# Altium schematic sheet Microcontroller.SchDoc
size A4; SheetNumber: 4; SheetTotal: 6
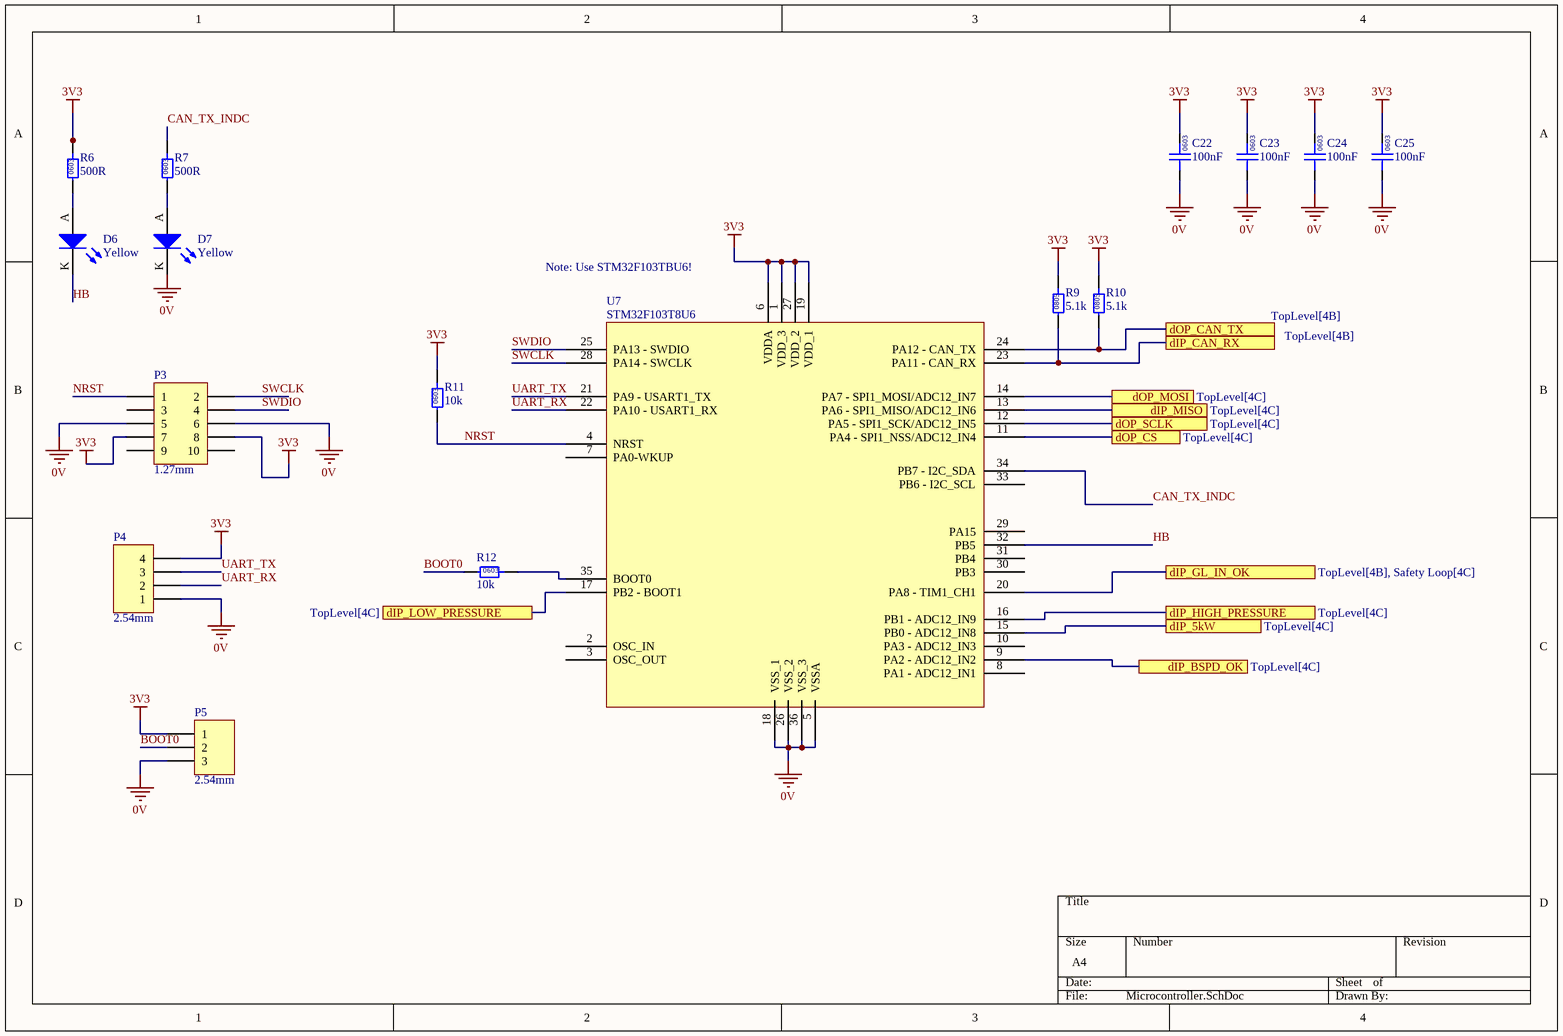
[diagram p0: Microcontroller.SchDoc]

## Parts
C22  100nF  [0603]
C23  100nF  [0603]
C24  100nF  [0603]
C25  100nF  [0603]
D6  Yellow  [0805 LED]
D7  Yellow  [0805 LED]
P3  1.27mm  [3221-10-0300-00]
P4  2.54mm  [TH 2.54mm Header 1x4]
P5  2.54mm  [TH 2.54mm Header 1x3]
R6  500R  [0603]
R7  500R  [0603]
R9  5.1k  [0805]
R10  5.1k  [0805]
R11  10k  [0603]
R12  10k  [0603]
U7  STM32F103T8U6  [STM_QFN-36]

## Ports
dIP_5kW (see TopLevel[4C]), dIP_BSPD_OK (see TopLevel[4C]), dIP_CAN_RX (see TopLevel[4B]), dIP_GL_IN_OK (see TopLevel[4B], Safety Loop[4C]), dIP_HIGH_PRESSURE (see TopLevel[4C]), dIP_LOW_PRESSURE (see TopLevel[4C]), dIP_MISO (see TopLevel[4C]), dOP_CAN_TX (see TopLevel[4B]), dOP_CS (see TopLevel[4C]), dOP_MOSI (see TopLevel[4C]), dOP_SCLK (see TopLevel[4C])

## Nets
0V: C22.1 C23.1 C24.1 C25.1 D7.K P3.5 P3.6 P4.1 P5.3 U7.5(VSSA) U7.18(VSS_1) U7.26(VSS_2) U7.36(VSS_3)
3V3: C22.2 C23.2 C24.2 C25.2 P3.7 P3.8 P4.4 P5.1 R6.2 R9.2 R10.2 R11.2 U7.1(VDD_3) U7.6(VDDA) U7.19(VDD_1) U7.27(VDD_2)
BOOT0: P5.2 R12.1
CAN_TX_INDC: R7.2 U7.34(PB7_-_I2C_SDA)
dIP_5kW: U7.15(PB0_-_ADC12_IN8) ; port dIP_5kW
dIP_BSPD_OK: U7.9(PA2_-_ADC12_IN2) ; port dIP_BSPD_OK
dIP_CAN_RX: R9.1 U7.23(PA11_-_CAN_RX) ; port dIP_CAN_RX
dIP_GL_IN_OK: U7.20(PA8_-_TIM1_CH1) ; port dIP_GL_IN_OK
dIP_HIGH_PRESSURE: U7.16(PB1_-_ADC12_IN9) ; port dIP_HIGH_PRESSURE
dIP_LOW_PRESSURE: U7.17(PB2_-_BOOT1) ; port dIP_LOW_PRESSURE
dIP_MISO: U7.13(PA6_-_SPI1_MISO/ADC12_IN6) ; port dIP_MISO
dOP_CAN_TX: R10.1 U7.24(PA12_-_CAN_TX) ; port dOP_CAN_TX
dOP_CS: U7.11(PA4_-_SPI1_NSS/ADC12_IN4) ; port dOP_CS
dOP_MOSI: U7.14(PA7_-_SPI1_MOSI/ADC12_IN7) ; port dOP_MOSI
dOP_SCLK: U7.12(PA5_-_SPI1_SCK/ADC12_IN5) ; port dOP_SCLK
HB: D6.K U7.32(PB5)
NRST: P3.1 R11.1 U7.4(NRST)
SWCLK: P3.2 U7.28(PA14_-_SWCLK)
SWDIO: P3.4 U7.25(PA13_-_SWDIO)
UART_RX: P4.2 U7.22(PA10_-_USART1_RX)
UART_TX: P4.3 U7.21(PA9_-_USART1_TX)
NetD6_A: D6.A R6.1
NetD7_A: D7.A R7.1
NetR12_2: R12.2 U7.35(BOOT0)

Not connected (* = marked no-connect by the designer): P3 3 9 10; U7 2(OSC_IN) 3(OSC_OUT) 7(PA0-WKUP) 8(PA1_-_ADC12_IN1) 10(PA3_-_ADC12_IN3) 29(PA15) 30(PB3) 31(PB4) 33(PB6_-_I2C_SCL)

## Notes on the sheet
- (near U7) Note: Use STM32F103TBU6!
- (in symbol GCM188L81H104KA57D) 0603
- (in symbol RC0603FR-0710KL) 0603
- (in symbol RC0805FR075K1L) 0805
- (in symbol RT0603BRD07500RL) 0603

## Library data of the parts
C22-C25 = GCM188L81H104KA57D: Manufacturer: muRata; Rated Voltage: 50V; Tolerance: ±10%; Material: MLCC; Temperature Rating: X8L; Part Number: GCM188L81H104KA57D; Value: 100nF; Digikey Part Number: 490-6049-1-ND
D6 D7 = SML-211YTT86: Yellow LED Indication - Discrete 1.75V 0805 (2012 Metric); Manufacturer: ROHM Semiconductor; Part Number: SML-211YTT86; Colour: Yellow; Digikey Part Number: 511-1293-1-ND
P3 = SMD 1.27mm Header 2x5 (3221-10-0300-00): Positions: 10; Angle: 0; Flange: No; Contact: NA; Part Number: SMD 1.27mm Header 2x5 (3221-10-0300-00); Pitch: 1.27mm; Row Spacing: 1.27mm
P4 = TH 2.54mm Header 1x4: Positions: 4; Angle: 0; Flange: No; Contact: NA; Part Number: TH 2.54mm Header 1x4; Pitch: 2.54mm; Row Spacing: 2.54mm
P5 = TH 2.54mm Header 1x3: Positions: 3; Angle: 0; Flange: No; Contact: NA; Part Number: TH 2.54mm Header 1x3; Pitch: 2.54mm; Row Spacing: 2.54mm
R6 R7 = RT0603BRD07500RL: Manufacturer: YAGEO; Tolerance: 0.01; Rated Power: 0.1W; Part Number: RT0603BRD07500RL; Value: 500R; Material: FR-07; Digikey Part Number: 13-RT0603BRD07500RL-ND
R9 R10 = RC0805FR075K1L: Manufacturer: YAGEO; Tolerance: 0.01; Rated Power: 0.125W; Part Number: RC0805FR075K1L; Value: 5.1k; Material: FR-07; Digikey Part Number: 311-5.10KCRCT-ND
R11 R12 = RC0603FR-0710KL: Manufacturer: YAGEO; Tolerance: 0.01; Rated Power: 0.1W; Part Number: RC0603FR-0710KL; Value: 10k; Digikey Part Number: 311-10.0KHRCT-ND; Material: FR-07
U7 = STM32F103T8U6: ARM® Cortex®-M3 STM32F1 Microcontroller IC 32-Bit 72MHz 64KB (64K x 8) FLASH QFN; Manufacturer: ST Microelectronics; Complex IC: 1; Part Number: STM32F103T8U6; Digikey Part Number: STM32F103T8U6; Digikey Link: https://www.digikey.com/en/products/detail/stmicroelectronics/stm32f103t8u6/1852493